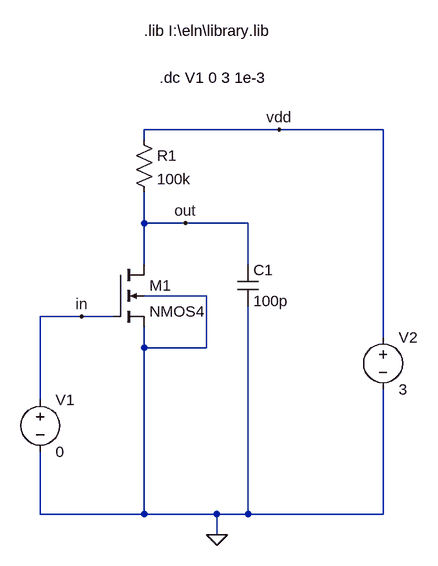
[diagram p0: schematic priklad1.asc]
priklad1.asc, the LTspice schematic file:
Version 4
SHEET 1 880 680
WIRE 208 -304 0 -304
WIRE 368 -304 208 -304
WIRE 0 -288 0 -304
WIRE 0 -160 0 -208
WIRE 64 -160 0 -160
WIRE 160 -160 64 -160
WIRE 0 -96 0 -160
WIRE 160 -96 160 -160
WIRE 96 -48 0 -48
WIRE -96 -16 -160 -16
WIRE -48 -16 -96 -16
WIRE 368 16 368 -304
WIRE 0 32 0 0
WIRE 96 32 96 -48
WIRE 96 32 0 32
WIRE -160 112 -160 -16
WIRE -160 288 -160 192
WIRE 0 288 0 32
WIRE 0 288 -160 288
WIRE 112 288 0 288
WIRE 160 288 160 -32
WIRE 160 288 112 288
WIRE 368 288 368 96
WIRE 368 288 160 288
WIRE 112 320 112 288
FLAG 112 320 0
FLAG 208 -304 vdd
FLAG 64 -160 out
FLAG -96 -16 in
SYMBOL voltage -160 96 R0
WINDOW 123 0 0 Left 2
WINDOW 39 0 0 Left 2
SYMATTR InstName V1
SYMATTR Value 0
SYMBOL nmos4 -48 -96 R0
SYMATTR InstName M1
SYMATTR Value NMOS4
SYMATTR Value2 l=1u w=1u
SYMBOL res -16 -304 R0
SYMATTR InstName R1
SYMATTR Value 100k
SYMBOL cap 144 -96 R0
SYMATTR InstName C1
SYMATTR Value 100p
SYMBOL voltage 368 0 R0
WINDOW 123 0 0 Left 2
WINDOW 39 0 0 Left 2
SYMATTR InstName V2
SYMATTR Value 3
TEXT 0 -456 Left 2 !.lib I:\\eln\\library.lib
TEXT 24 -384 Left 2 !.dc V1 0 3 1e-3

The netlist it stands for:
* priklad1.asc
V1 in 0 0
M1 out in 0 0 NMOS4 l=1u w=1u
R1 vdd out 100k
C1 out 0 100p
V2 vdd 0 3
.model NMOS NMOS
.model PMOS PMOS
.lib standard.mos
.lib I:\eln\library.lib
.dc V1 0 3 1e-3
.backanno
.end